# Altium schematic sheet Ethernet.SchDoc: Name project title here
size A3; Organization: Krakul OÜ; Address1: Kaare tee 3, lubja; Address2: viimsi vald; Address3: harju maakond; Address4: Estonia 74010; DocumentNumber: No here; Revision: 0; SheetNumber: 2; SheetTotal: 7
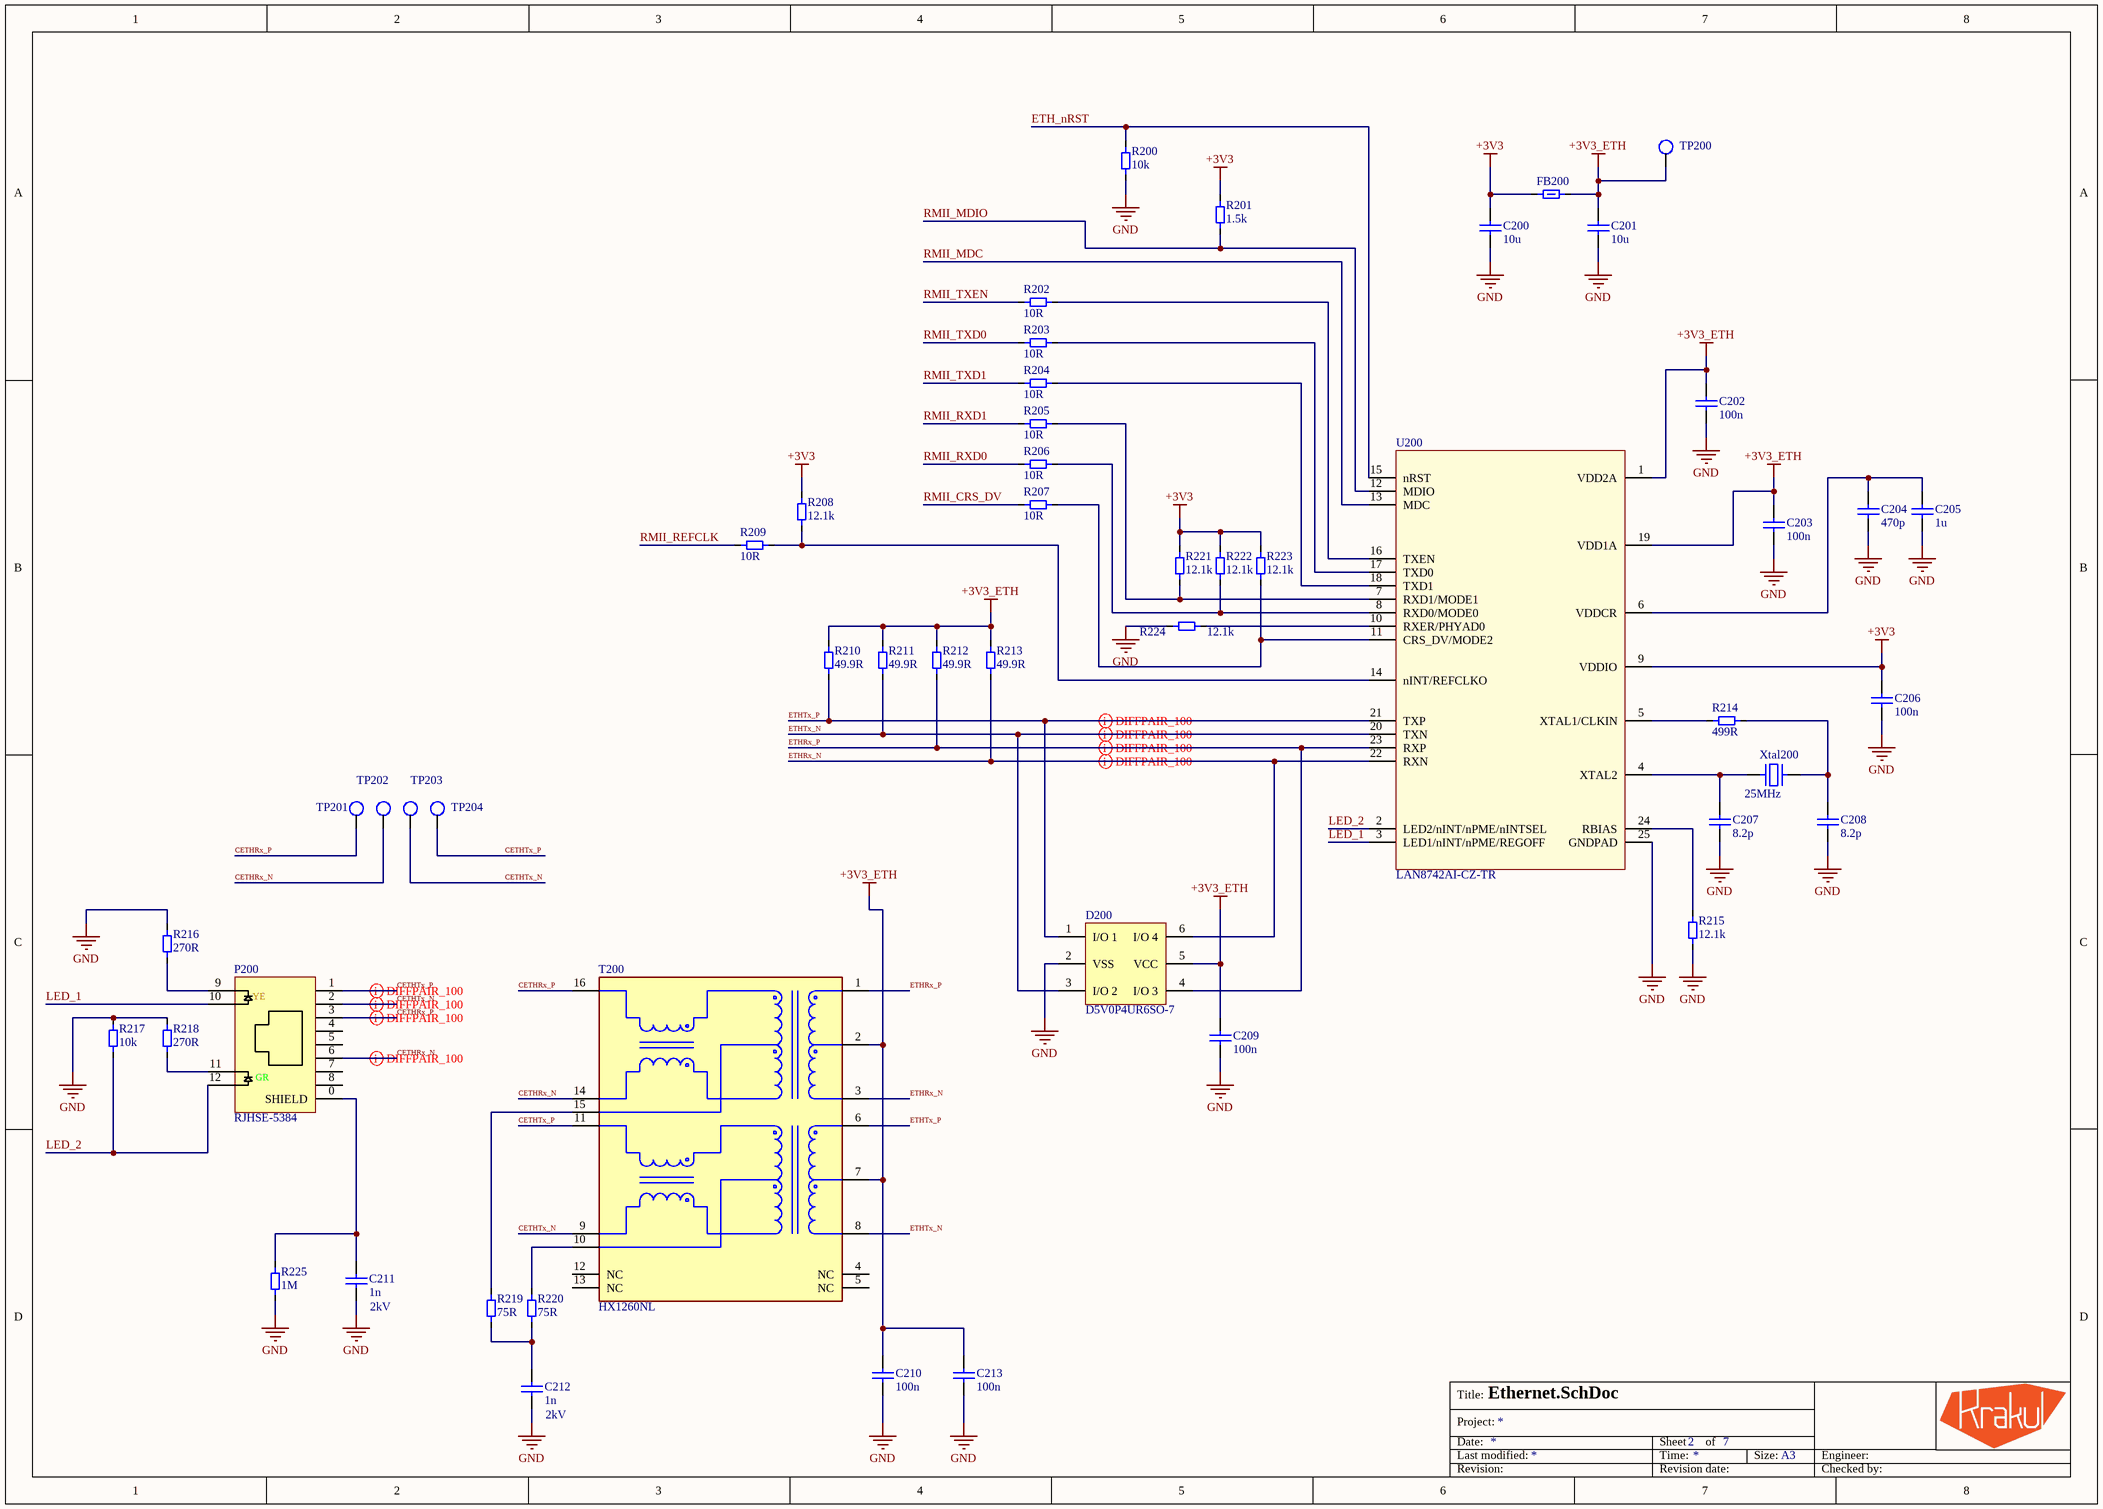
[diagram p0: Ethernet.SchDoc]

## Parts
C200  10u  [MLCC_0603_M]
C201  10u  [MLCC_0603_M]
C202  100n  [MLCC_0402_M]
C203  100n  [MLCC_0402_M]
C204  470p  [MLCC_0402_M]
C205  1u  [MLCC_0603_M]
C206  100n  [MLCC_0402_M]
C207  8.2p  [MLCC_0402_M]
C208  8.2p  [MLCC_0402_M]
C209  100n  [MLCC_0402_M]
C210  100n  [MLCC_0402_M]
C211  1n  Voltage Rating (DC): 2kV  [MLCC_1206_M]
C212  1n  Voltage Rating (DC): 2kV  [MLCC_1206_M]
C213  100n  [MLCC_0402_M]
D200  D5V0P4UR6SO-7  [SOT26]
FB200  BLM18RK601SN1D  [FP-BLM18-0_15-t0_8-IPC_B]  (value not drawn)
P200  RJHSE-5384  [RJHSE-5384]
R200  10k  [Resistor_0603_M]
R201  1.5k  [Resistor_0402_M]
R202  10R  [Resistor_0402_M]
R203  10R  [Resistor_0402_M]
R204  10R  [Resistor_0402_M]
R205  10R  [Resistor_0402_M]
R206  10R  [Resistor_0402_M]
R207  10R  [Resistor_0402_M]
R208  12.1k  [Resistor_0402_M]
R209  10R  [Resistor_0402_M]
R210  49.9R  [Resistor_0402_M]
R211  49.9R  [Resistor_0402_M]
R212  49.9R  [Resistor_0402_M]
R213  49.9R  [Resistor_0402_M]
R214  499R  [Resistor_0402_M]
R215  12.1k  [Resistor_0402_M]
R216  270R  [Resistor_0402_M]
R217  10k  [Resistor_0603_M]
R218  270R  [Resistor_0402_M]
R219  75R  [Resistor_0603_M]
R220  75R  [Resistor_0603_M]
R221  12.1k  [Resistor_0402_M]
R222  12.1k  [Resistor_0402_M]
R223  12.1k  [Resistor_0402_M]
R224  12.1k  [Resistor_0402_M]
R225  1M  [Resistor_1206_M]
T200  HX1260NL  [FP-H1102NL-MFG]
TP200  Testpoint 1mm  [Testpoint 1mm]  (value not drawn)  (no BOM)
TP201  Testpoint 1mm  [Testpoint 1mm]  (value not drawn)  (no BOM)
TP202  Testpoint 1mm  [Testpoint 1mm]  (value not drawn)  (no BOM)
TP203  Testpoint 1mm  [Testpoint 1mm]  (value not drawn)  (no BOM)
TP204  Testpoint 1mm  [Testpoint 1mm]  (value not drawn)  (no BOM)
U200  LAN8742AI-CZ-TR  [24-VFQFN Exposed Pad based on LAN8742AI-CZ-TR]
Xtal200  Frequency: 25MHz  [4-SMD Crystal 2.00mm x 1.60mm]  (hidden comment: ECS-250-10-37B-CTN-TR)

## Nets
+3V3: C200.2 C206.2 FB200.1 R201.2 R208.2 R221.2 R222.2 R223.2 U200.9(VDDIO)
+3V3_ETH: C201.2 C202.2 C203.2 C209.2 C210.2 C213.2 D200.5(VCC) FB200.2 R210.2 R211.2 R212.2 R213.2 T200.2(CT) T200.7(CT) TP200.1 U200.1(VDD2A) U200.19(VDD1A)
GND: C200.1 C201.1 C202.1 C203.1 C204.1 C205.1 C206.1 C207.1 C208.1 C209.1 C210.1 C211.2 C212.1 C213.1 D200.2(VSS) R200.1 R215.1 R216.2 R217.2 R218.2 R224.1 R225.1 U200.25(GNDPAD) Xtal200.2(GND) Xtal200.4(GND)
CETHRx_N: P200.6 T200.14(TX-) TP202.1
CETHRx_P: P200.3 T200.16(TX+) TP201.1
CETHTx_N: P200.2 T200.9(RX-) TP203.1
CETHTx_P: P200.1 T200.11(RX+) TP204.1
ETH_nRST: R200.2 U200.15(nRST)
ETHRx_N: D200.6(I/O_4) R213.1 T200.3(TD-) U200.22(RXN)
ETHRx_P: D200.4(I/O_3) R212.1 T200.1(TD+) U200.23(RXP)
ETHTx_N: D200.3(I/O_2) R211.1 T200.8(RD-) U200.20(TXN)
ETHTx_P: D200.1(I/O_1) R210.1 T200.6(RD+) U200.21(TXP)
LED_1: P200.10 U200.3(LED1/nINT/nPME/REGOFF)
LED_2: P200.12 R217.1 U200.2(LED2/nINT/nPME/nINTSEL)
RMII_CRS_DV: R207.1
RMII_MDC: U200.13(MDC)
RMII_MDIO: R201.1 U200.12(MDIO)
RMII_REFCLK: R209.1
RMII_RXD0: R206.1
RMII_RXD1: R205.1
RMII_TXD0: R203.1
RMII_TXD1: R204.1
RMII_TXEN: R202.1
NetC204_2: C204.2 C205.2 U200.6(VDDCR)
NetC207_2: C207.2 U200.4(XTAL2) Xtal200.1
NetC208_2: C208.2 R214.2 Xtal200.3
NetC211_1: C211.1 P200.0(SHIELD) R225.2
NetC212_2: C212.2 R219.1 R220.1
NetP200_9: P200.9 R216.1
NetP200_11: P200.11 R218.1
NetR202_2: R202.2 U200.16(TXEN)
NetR203_2: R203.2 U200.17(TXD0)
NetR204_2: R204.2 U200.18(TXD1)
NetR205_2: R205.2 R221.1 U200.7(RXD1/MODE1)
NetR206_2: R206.2 R222.1 U200.8(RXD0/MODE0)
NetR207_2: R207.2 R223.1 U200.11(CRS_DV/MODE2)
NetR208_1: R208.1 R209.2 U200.14(nINT/REFCLKO)
NetR214_1: R214.1 U200.5(XTAL1/CLKIN)
NetR215_2: R215.2 U200.24(RBIAS)
NetR219_2: R219.2 T200.15(NC)
NetR220_2: R220.2 T200.10(NC)
NetR224_2: R224.2 U200.10(RXER/PHYAD0)

Not connected (* = marked no-connect by the designer): P200 4 5 7 8; T200 4(NC) 5(NC) 12(NC) 13(NC)

## Layout directives
differential pair: CETHRx_N, CETHRx_P, CETHTx_N, CETHTx_P, ETHRx_N, ETHRx_P, ETHTx_N, ETHTx_P

## Notes on the sheet
- Title:
- Date:
- Last modified:
- Project:
- Sheet
- Time:
- of
- Size:
- A3
- Engineer:
- Revision:
- Revision date:
- Checked by:
- (in symbol CMP-001-1345-1) YE; GR

## Library data of the parts
C200 C201 = CMP-001-1355-1: MLCC, 0603, 10u, 10%, 25V, X5R; Manufacturer: Any; Value: 10µF; Capacitor Type: Ceramic; Voltage: 25V; Dielectric: X5R; Case/Package: 0603; Part number: MLCC, 0603, 10u, 10%, 25V, X5R; RoHS: Yes; Mount: SMD
C202 C203 C206 C209 C210 C213 = CMP-001-1256-2: MLCC, 0402, 100n, 10%, 10V, X5R; Manufacturer: Any; Capacitor Type: Ceramic; Value: 100nF; Case/Package: 0402; Part number: MLCC, 0402, 100n, 10%, 10V, X5R; RoHS: Yes; Tolerance: 10%; Mount: SMD; Voltage: 10V; Dielectric: X5R
C204 = CMP-0001-00137-2: MLCC, 0402, 470p, 5%, 50V, C0G/NP0; Manufacturer: Any; Capacitor Type: Ceramic; Value: 470pF; Case/Package: 0402; Part number: MLCC, 0402, 470p, 5%, 50V, C0G/NP0; Dielectric: C0G/NP0; Tolerance: 5%; Mount: SMD; Voltage: 50V; RoHS: Yes
C205 = CMP-001-0642-2: MLCC, 0603, 1u, 10%, 10V, X7R; Manufacturer: Any; Capacitor Type: Ceramic; Value: 1µF; Mount: SMD; Tolerance: 10%; Case/Package: 0603; Part number: MLCC, 0603, 1u, 10%, 10V, X7R; RoHS: Yes; Voltage: 10V; Dielectric: X7R
C207 C208 = CMP-0001-00091-2: MLCC, 0402, 8.2p, 5%, 50V, C0G/NP0; Manufacturer: Any; Value: 8.2pF; Capacitor Type: Ceramic; Part number: MLCC, 0402, 8.2p, 5%, 50V, C0G/NP0; Voltage: 50V; Mount: SMD; Tolerance: 5%; Case/Package: 0402; RoHS: Yes; Dielectric: C0G/NP0
C211 C212 = CMP-001-1275-2: MLCC, 1206, 1n, 10%, 2kV, X7R; Manufacturer: Any; Insulation Resistance: 10GR; Value: 1nF; Dissipation Factor: 2.5%; Capacitor Type: Ceramic; Min Operating Temperature: -55°C; Case Code (Imperial): 1206; Voltage Rating: 2kV; Max Operating Temperature: 125°C; Lead Free: Lead Free; REACH SVHC: Unknown; Radiation Hardening: No; Depth: 1.6mm; Capacitance: 1nF; Part number: MLCC, 1206, 1n, 10%, 2kV, X7R; Width: 0.063inch; Termination: SMD/SMT; Voltage: 2kV; Case Code (Metric): 3216; Number of Pins: 2; Package Quantity: 1; Mount: Surface Mount; Tolerance: 10%; Thickness: 0.057inch; Composition: Ceramic; Height: 1.25mm; Case/Package: 1206; RoHS: Yes; Packaging: Tape and Reel; Length: 3.2mm; Dielectric: X7R
D200 = CMP-ROOT-00693-1: DIODES INC. - D5V0P4UR6SO-7 - ESD Protection Device, 1.2 V, SOT-26, 6 Pins, 3.6 V, 300 mW; Pins: 6; Part number: D5V0P4UR6SO-7; Manufacturer: Diodes Inc; Mount: Surface Mount; Case/Package: SOT-23-6; RoHS: Yes
FB200 = CMP-ROOT-01073-2: Ferrite Beads Multi-Layer 600Ohm 25% 100MHz 200mA 600mOhm DCR 0603 T/R; Manufacturer: Murata; Manufacturer Series: BLM18R; DC Resistance (DCR): 600mR; ESR (Equivalent Series Resistance): 600R; Material: Ferrite,Steel; Number of Circuits: 1; Case/Package: 0603; Mount: SMD; Part number: BLM18RK601SN1D; Pins: 2; RoHS: Yes; Contact Plating: Tin,Matte; Core Material: Ferrite; Current Rating: 200mA; DC Resistance-Max: 600mR; Height: 0.8mm; Lead Free: Lead Free; Length: 1.6mm; Max Current Rating: 200mA; Max DC Current: 200mA; Max Operating Temperature: 125°C; Min Operating Temperature: -55°C
P200 = CMP-001-1345-1: CONN MOD JACK 8P8C R/A SHIELDED, LEFT GREEN, RIGHT YELLOW; Manufacturer: Amphenol ICC; Contact Resistance: 20mR; Connector Type: Jack,RJ45; Direction: Up; Current Rating: 1.5A; Voltage Rating: 125V; Pitch: 2.03mm; Number of Positions Loaded: 8; Number of Ports: 1; Gender: Female; Depth: 15.75mm; Radiation Hardening: No; Max Operating Temperature: 85°C; Housing Material: Thermoplastic; Flammability Rating: UL94 V-0; Part number: RJHSE-5384; Lead Free: Lead Free; Voltage Rating (DC): 125V; Packaging: Tray; REACH SVHC: Unknown; Package Quantity: 120; Termination: Through Hole; Length: 16.51mm; Contact Plating: Gold; Orientation: Right Angle; Max Voltage Rating (AC): 125V; Color: Green,Yellow,Black; Min Operating Temperature: -55°C; Contact Material: Bronze; Number of Rows: 1; RoHS: Yes; Mount: Through Hole; Shielding: Shielded; Max Current Rating: 1.5A; Number of Contacts: 8; Pins: 12; Number of Positions: 8
R200 R217 = CMP-001-0101-2: Resistor, 0603, 10k, 1%, 1/10W; Manufacturer: Any; Power: 100mW; Tolerance: 1%; Value: 10k; RoHS: Yes; Mount: SMD; Case/Package: 0603; Part number: Resistor, 0603, 10k, 1%, 1/10W
R201 = CMP-001-0344-2: Resistor, 0402, 1.5k, 1%, 1/16W; Manufacturer: Any; Power: 62mW; Mount: SMD; Tolerance: 1%; Value: 1.5k; RoHS: Yes; Case/Package: 0402; Part number: Resistor, 0402, 1.5k, 1%, 1/16W
R202-R207 R209 = CMP-001-0292-2: Resistor, 0402, 10R, 1%, 1/16W; Manufacturer: Any; Power: 62mW; Value: 10; Part number: Resistor, 0402, 10R, 1%, 1/16W; Case/Package: 0402; RoHS: Yes; Tolerance: 1%; Mount: SMD
R208 R215 R221-R224 = CMP-001-1424-1: Resistor, 0402, 12.1k, 1%, 1/16W; Manufacturer: Any; Power: 62mW; Case/Package: 0402; Value: 12.1k; Mount: SMD; RoHS: Yes; Tolerance: 1%; Part number: Resistor, 0402, 12.1k, 1%, 1/16W
R210-R213 = CMP-001-1276-1: Resistor, 0402, 49.9R, 1%, 1/16W; Manufacturer: Any; Max Power Dissipation: 63mW; Power Rating: 62.5mW; Power: 62mW; Voltage Rating: 50V; Value: 49.9; Temperature Coefficient: 100ppm/°C; Length: 1mm; Height: 0.016inch; Min Operating Temperature: -55°C; Number of Pins: 2; Width: 0.5mm; Depth: 0.5mm; Case Code (Metric): 1005; Case/Package: 0402; Part number: Resistor, 0402, 49.9R, 1%, 1/16W; Termination: SMD/SMT; REACH SVHC: No SVHC; Number of Terminations: 2; Package Quantity: 1; Composition: Thick Film; Resistance: 49.9R; RoHS: Yes; Tolerance: 1%; Working Voltage: 50V; Case Code (Imperial): 0402; Packaging: Tape and Reel; Max Operating Temperature: 155°C; Features: Moisture Resistant; Voltage Rating (DC): 50V; Military Standard: Not; Lead Free: Lead Free; Mount: SMD
R214 = CMP-001-1365-1: Resistor, 0402, 499R, 1%, 1/16W; Manufacturer: Any; Power: 62mW; Value: 499; Part number: Resistor, 0402, 499R, 1%, 1/16W; Tolerance: 1%; Mount: SMD; RoHS: Yes; Case/Package: 0402
R216 R218 = CMP-001-0326-2: Resistor, 0402, 270R, 1%, 1/16W; Manufacturer: Any; Power: 62mW; Value: 270; Tolerance: 1%; Case/Package: 0402; Part number: Resistor, 0402, 270R, 1%, 1/16W; RoHS: Yes; Mount: SMD
R219 R220 = CMP-001-0051-3: Resistor, 0603, 75R, 1%, 1/10W; Manufacturer: Any; Power: 100mW; Value: 75; RoHS: Yes; Part number: Resistor, 0603, 75R, 1%, 1/10W; Case/Package: 0603; Mount: SMD; Tolerance: 1%
R225 = CMP-0001-00051-1: Resistor, 1206, 1M, 1%, 1/4W; Manufacturer: Any; Case/Package: 1206; RoHS: Yes; Value: 1M; Mount: SMD; Part number: Any
T200 = CMP-ROOT-01078-2: Telecom Transformer 1: 1 0.65Ohm Prim. DCR 0.65Ohm Sec. DCR 16 Terminal Gull Wing SMD; Manufacturer: Pulse; Value: 350uH; Isolation Voltage: 1.5kV; Shielding: Unshielded; Turns Ratio: 1:1; Case/Package: Module; Mount: SMD; Part number: HX1260NL; Pins: 16; RoHS: Yes; Height: 6mm; Height - Seated (Max): 6.25mm; Lead/Base Style: Gull Wing; Length: 12.7mm; Max Operating Temperature: 85°C; Min Operating Temperature: -40°C; Mounting Technology: Surface Mount; Package Quantity: 40; Packaging: Rail/Tube; RoHS Compliant: Yes; Series: Star Magnetics™; Termination: SMD/SMT; Width: 7.11mm
TP200-TP204 = CMP-001-1238-1
U200 = CMP-ROOT-00367-2: Small Footprint RMII 10/100 Ethernet Transceiver with flexPWR Technology; Manufacturer: Microchip Technology; Simplex/Duplex: Full Duplex; Max Supply Voltage: 3.3V; Min Supply Voltage: 1.8V; Number of Transceivers: 1; Data Rate: 100Mbps; Case/Package: QFN; Mount: Surface Mount; Part number: LAN8742AI-CZ-TR; Min Operating Temperature: -40°C; Radiation Hardening: No; RoHS: Yes; Max Operating Temperature: 85°C; Number of Pins: 24; Packaging: Tape and Reel; Package Quantity: 5000
Xtal200 = CMP-001-1313-1: 25MHz ±10ppm Crystal 10pF 50 Ohms 4-SMD, No Lead; Manufacturer: ECS Inc.; Case/Package: 4-SMD 2.0x1.6; Part number: ECS-250-10-37B-CTN-TR; Pins: 4; Mount: SMD; RoHS: Yes